# EAGLE schematic common_board_smd (EAGLE 6.5.0)
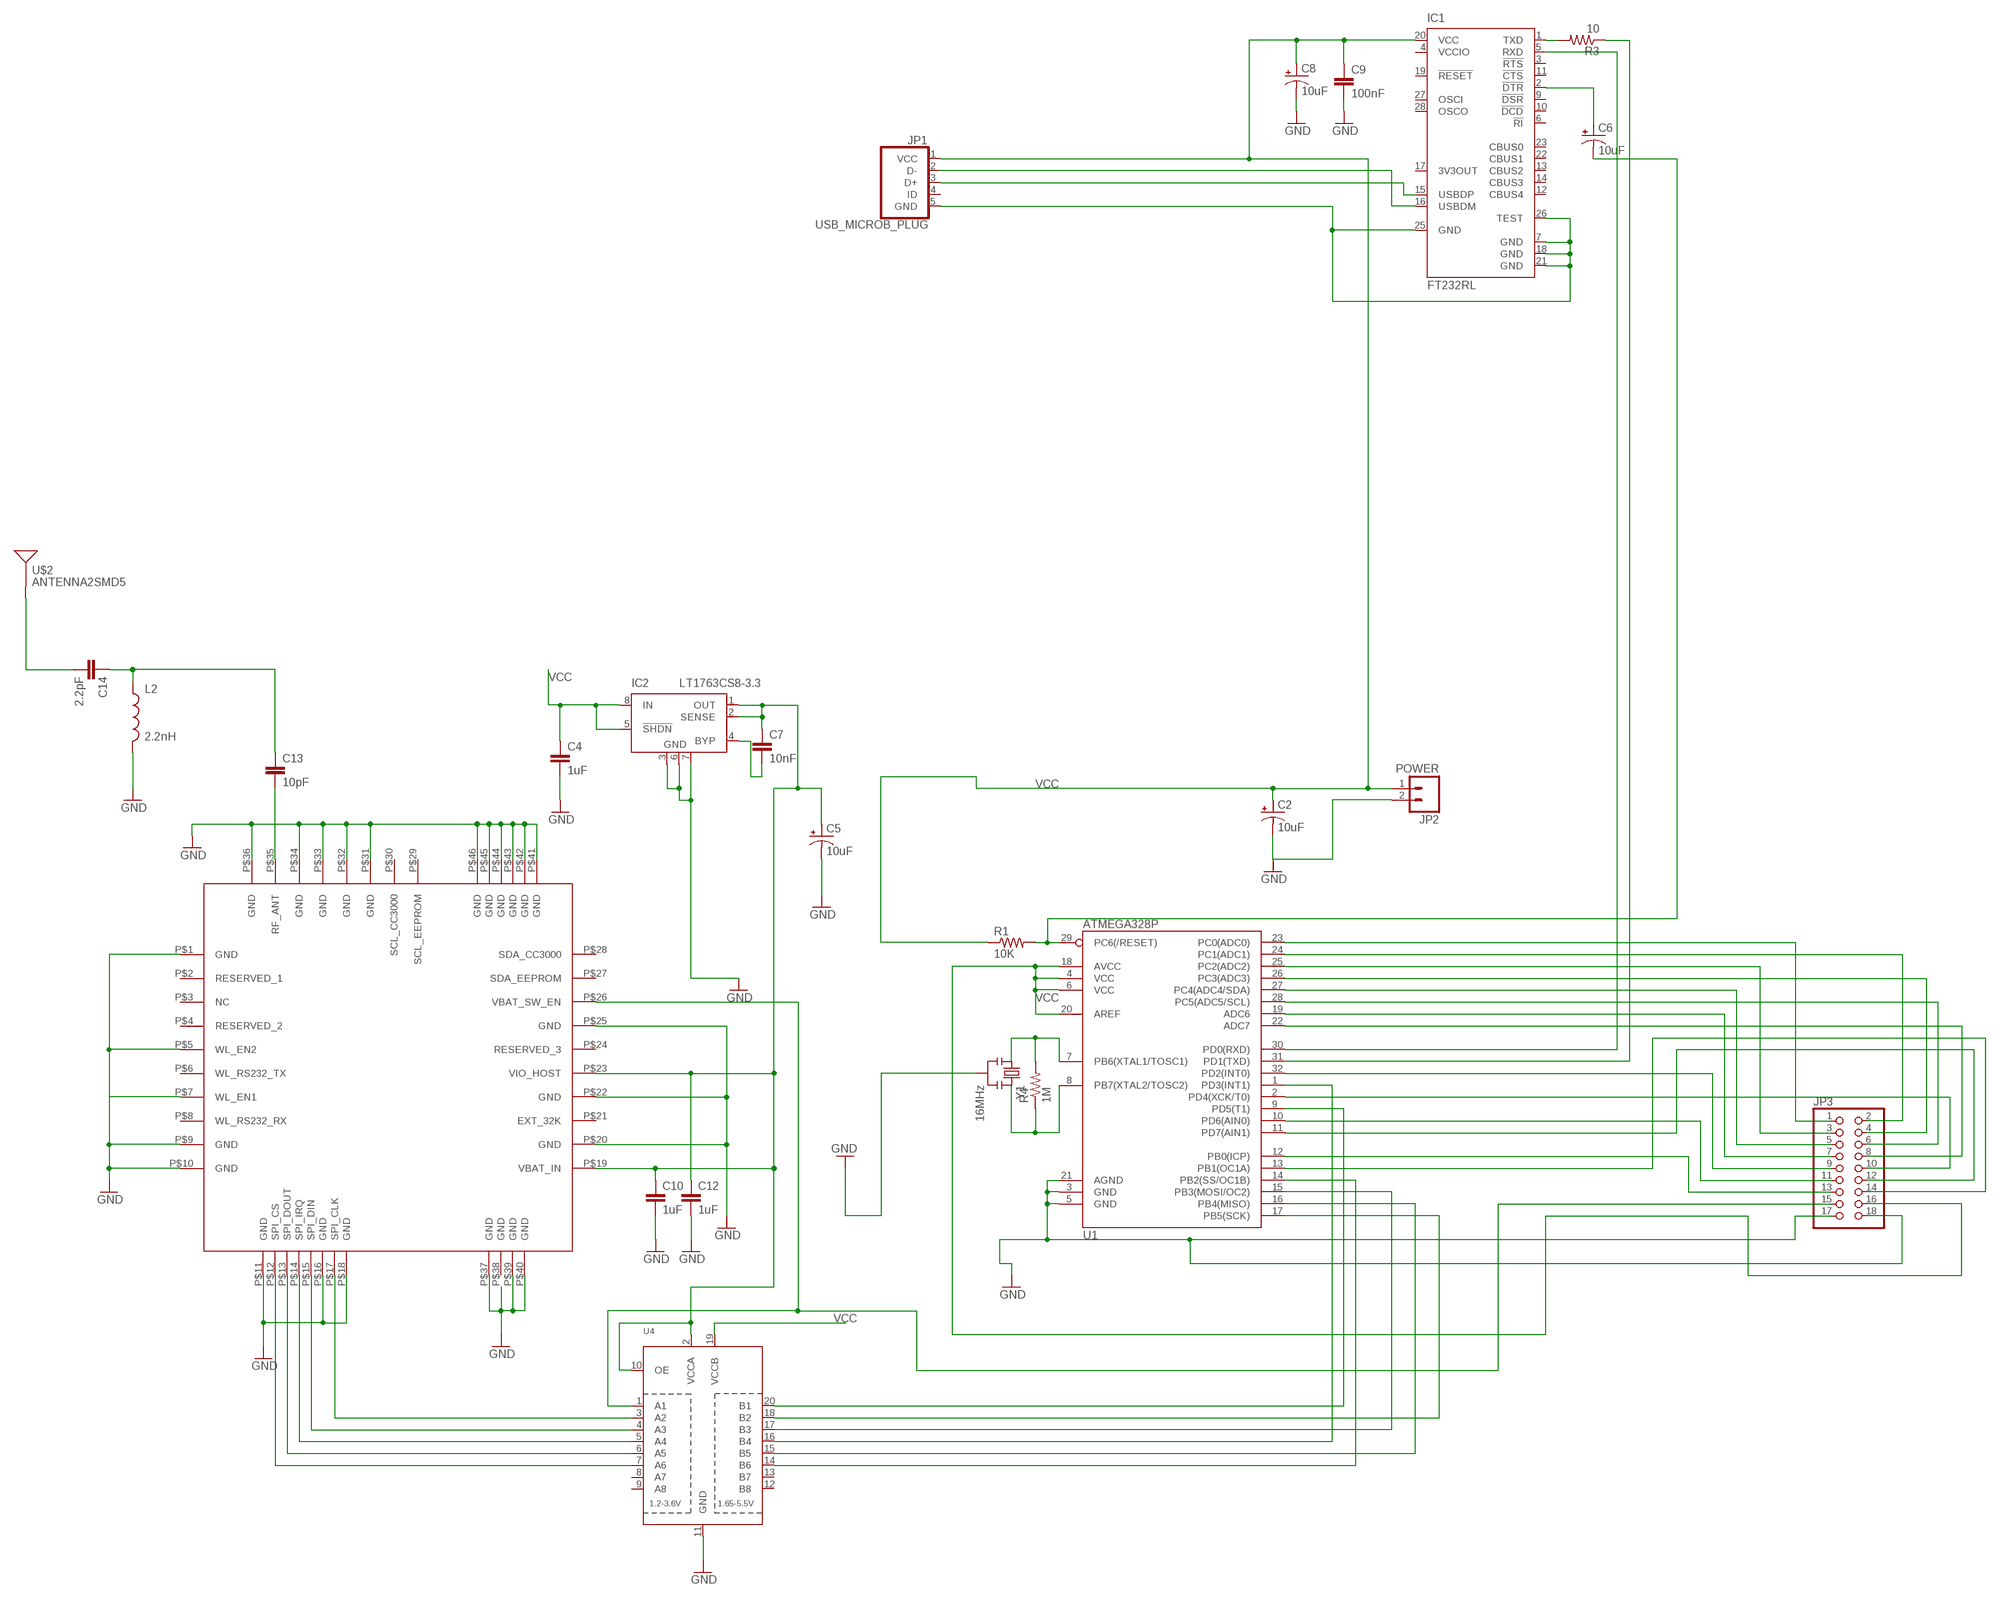
[diagram p0: schematic, sheet 1]

## Parts
C2  10uF  CAP_POL1206  [EIA3216]
C4  1uF  CAP0805  [0805]
C5  10uF  CAP_POL3528  [EIA3528]
C6  10uF  CAP_POL1206  [EIA3216]
C7  10nF  CAP0805  [0805]
C8  10uF  CAP_POL1206  [EIA3216]
C9  100nF  CAP0805  [0805]
C10  1uF  CAP1206  [1206]
C12  1uF  CAP1206  [1206]
C13  10pF  CAP0805  [0805]
C14  2.2pF  CAP0805  [0805]
IC1  FT232RL  [SSOP28]
IC2  LT1763CS8-3.3  [SOIC8]
JP1  USB_MICROB_PLUG  [MICRO-B-RA-SMT]
JP2  POWER  M02PTH  [1X02]
JP3  PINHD-2X9-BIG  [2X09-BIG]
L2  2.2nH  INDUCTOR0805  [0805]
R1  10K  RESISTOR0805-RES  [0805]
R3  10  RESISTOR0805-RES  [0805]
R4  1M  RESISTOR0603-RES  [0603-RES]
U1  ATMEGA328P  ATMEGA328_SMT  [TQFP32-08]
U4  TXB0108PWR  [TSSOP20]
U$1  CC3000  [CC3000]
U$2  ANTENNA2SMD5  [ANTENNA-CHIP5]
Y1  16MHz  RESONATOR16MHZ  [RESONATOR-SMD]

## Nets
GND [gnd]: C2.C(-) C4.2 C5.C(-) C8.C(-) C9.2 C10.2 C12.2 IC2.3(GND) IC2.6(GND) IC2.7(GND) JP2.2 JP3.17 JP3.18 L2.2 U1.3(GND) U1.5(GND) U1.21(AGND) U4.11(GND) U$1.P$1(GND) U$1.P$5(WL_EN2) U$1.P$7(WL_EN1) U$1.P$9(GND) U$1.P$10(GND) U$1.P$11(GND) U$1.P$16(GND) U$1.P$18(GND) U$1.P$20(GND) U$1.P$22(GND) U$1.P$25(GND) U$1.P$31(GND) U$1.P$32(GND) U$1.P$33(GND) U$1.P$34(GND) U$1.P$36(GND) U$1.P$37(GND) U$1.P$39(GND) U$1.P$40(GND) U$1.P$41(GND) U$1.P$42(GND) U$1.P$43(GND) U$1.P$44(GND) U$1.P$45(GND) U$1.P$46(GND) Y1.2
N$1: U1.9(PD5(T1)) U4.20(B1)
N$2: U1.1(PD3(INT1)) U4.16(B4)
N$3: C6.C(-) R1.2 U1.29(PC6(/RESET))
N$4: R4.2 U1.7(PB6(XTAL1/TOSC1)) Y1.1
N$5: U1.17(PB5(SCK)) U4.18(B2)
N$6: U1.14(PB2(SS/OC1B)) U4.14(B6)
N$7: JP3.14 U1.13(PB1(OC1A))
N$8: C5.A(+) C7.1 C10.1 C12.1 IC2.1(OUT) IC2.2(SENSE) U4.2(VCCA) U4.10(OE) U$1.P$19(VBAT_IN) U$1.P$23(VIO_HOST)
N$9: U4.7(A6) U$1.P$12(SPI_CS)
N$10: U4.6(A5) U$1.P$13(SPI_DOUT)
N$11: U4.5(A4) U$1.P$14(SPI_IRQ)
N$12: U4.4(A3) U$1.P$15(SPI_DIN)
N$13: U4.3(A2) U$1.P$17(SPI_CLK)
N$14: JP3.15 U4.1(A1) U$1.P$26(VBAT_SW_EN)
N$15: IC1.1(TXD) R3.2
N$16: C13.2 U$1.P$35(RF_ANT)
N$17: C13.1 C14.1 L2.1
N$18: C14.2 U$2.FEED(SIGNAL)
N$19: U1.16(PB4(MISO)) U4.15(B5)
N$20: U1.15(PB3(MOSI/OC2)) U4.17(B3)
N$21: JP3.9 U1.32(PD2(INT0))
N$22: JP3.13 U1.12(PB0(ICP))
N$23: JP3.3 U1.25(PC2(ADC2))
N$24: JP3.8 U1.22(ADC7)
N$25: JP3.1 U1.23(PC0(ADC0))
N$26: JP3.12 U1.11(PD7(AIN1))
N$27: JP3.2 U1.24(PC1(ADC1))
N$28: IC1.15(USBDP) JP1.3(D+)
N$29: IC1.16(USBDM) JP1.2(D-)
N$30: R3.1 U1.31(PD1(TXD))
N$31: IC1.5(RXD) U1.30(PD0(RXD))
N$32: C6.A(+) IC1.2(!DTR)
N$33: JP3.4 U1.26(PC3(ADC3))
N$34: JP3.5 U1.27(PC4(ADC4/SDA))
N$35: JP3.6 U1.28(PC5(ADC5/SCL))
N$36: JP3.7 U1.19(ADC6)
N$38: JP3.10 U1.2(PD4(XCK/T0))
N$39 [gnd]: IC1.7(GND) IC1.18(GND) IC1.21(GND) IC1.25(GND) IC1.26(TEST) JP1.5(GND)
N$41: R4.1 U1.8(PB7(XTAL2/TOSC2)) Y1.3
N$42: C7.2 IC2.4(BYP)
N$43: JP3.11 U1.10(PD6(AIN0))
VCC [usbvcc]: C2.A(+) C4.1 C8.A(+) C9.1 IC1.20(VCC) IC2.5(!SHDN) IC2.8(IN) JP1.1(VCC) JP2.1 JP3.16 R1.1 U1.4(VCC) U1.6(VCC) U1.18(AVCC) U1.20(AREF) U4.19(VCCB)
Unconnected: IC1.3(!RTS) IC1.6(!RI) IC1.9(!DSR) IC1.10(!DCD) IC1.11(!CTS) IC1.12(CBUS4) IC1.13(CBUS2) IC1.14(CBUS3) IC1.17(3V3OUT) IC1.19(!RESET) IC1.22(CBUS1) IC1.23(CBUS0) IC1.27(OSCI) IC1.28(OSCO) JP1.4(ID) U4.8(A7) U4.9(A8) U4.12(B8) U4.13(B7) U$1.P$2(RESERVED_1) U$1.P$3(NC) U$1.P$4(RESERVED_2) U$1.P$6(WL_RS232_TX) U$1.P$8(WL_RS232_RX) U$1.P$21(EXT_32K) U$1.P$24(RESERVED_3) U$1.P$27(SDA_EEPROM) U$1.P$28(SDA_CC3000) U$1.P$38(GND)

## Power pins joined to a net without a drawn wire
SCL_CC3000: U$1.P$30(SCL_CC3000)
SCL_EEPROM: U$1.P$29(SCL_EEPROM)
VCCIO: IC1.4(VCCIO)

## Library data of the parts
C2 C5 C6 C8 = SparkFun-Passives:CAP_POL: Capacitor Polarized These are standard SMD and PTH capacitors. Normally 10uF, 47uF, and 100uF in electrolytic and tantalum varieties. Always verify the external diameter of the through hole cap, it varies with capacity, voltage, and manufacturer. The EIA devices should be standard.
C4 C7 C9 C10 C12-C14 = SparkFun-Capacitors:CAP: Capacitor Standard 0603 ceramic capacitor, and 0.1" leaded capacitor.
IC1 = ftdichip:FT232R: Source: http://www.ftdichip.com/Documents/DataSheets/DS_FT232R_v104.pdf; MPN: FT232RL; OC_FARNELL: 1146032; OC_NEWARK: 91K9918
IC2 = linear-technology:LT1763CS8: 500mA, Low Noise, LDO Micropower Regulators Source: http://cds.linear.com/docs/Datasheet/1763ff.pdf; MPN: LT1763CS8-3.3; OC_FARNELL: 1273617; OC_NEWARK: 57M6055
JP1 = SparkFun-Connectors:USB_MICROB_PLUG: USB Micro-B Plug Comes in a variety of packages. Check out Hirose's ZX-x0 line: http://www.hirose.co.jp/cataloge_hp/e24200011.pdf
JP2 = SparkFun-Connectors:M02: Standard 2-pin 0.1" header. Use with - straight break away headers ( PRT-00116) - right angle break away headers (PRT-00553) - swiss pins (PRT-00743) - machine pins (PRT-00117) - female headers (PRT-00115) Molex polarized connector foot print use with: PRT-08233 with associated crimp pins and housings. 2.54_SCREWTERM for use with PRT-10571. 3.5mm Screw Terminal footprints for PRT-08084 5mm Screw Terminal footprints for use with PRT-08433
JP3 = adafruit:PINHD-2X9: PIN HEADER With larger annulars
L2 = SparkFun-Passives:INDUCTOR: Inductors Basic Inductor/Choke - 0603 and 1206. Footprints are not proven and vary greatly between part numbers. SRN6045- 33uH, 20% 1.4A
R1 R3 = SparkFun-Passives:RESISTOR: Resistor Basic schematic elements and footprints for 0603, 1206, and PTH resistors.
R4 = SparkFun-Resistors:RESISTOR: Resistor Basic schematic elements and footprints for 0603, 1206, and PTH resistors.
U1 = SparkFun-DigitalIC:ATMEGA328_SMT: 32-Pin Atmega328 part Commonly used on Arduino compatible boards Available in QFP and QFN packages TQFP is IC-09069 QFN is non-stock; PROD_ID: IC-09069
U4 = adafruit:TXB0108PWR: 8-Bit Bi-Directional Level Shifter 1.2V-3.6V (VCCA) to 1.65V-5.5V (VCCB) bi-directional level shifter with auto direction sensing. Max data rate - VCCA 1.8V: 20Mbps (50ns), VCCA 3.3V: 100Mbps (10ns) Digikey: 296-21527-1-ND
U$1 = centerblack_engineering:CC3000: TI SimpleLink CC3000 Module - WiFi 802.11b/g Network Processor; AUTHOR: Matt Bigarani; DATASHEET: http://www.ti.com/lit/ds/symlink/cc3000.pdf; DATE: 2/8/2013
U$2 = SparkFun-RF-Modified:ANTENNA2: Chip antenna Single endded antenna. Common with smaller chip antennas. CHIP4 package is the GPS Chip Antenna SKU: GPS-08418. CHIP5 package is 2.4GHz chip antenna SKU: WRL-00144.
Y1 = SparkFun-FreqCtrl:RESONATOR: Resonator Small SMD resonator. Used, eg, on the Arduino Pro/ Pro Mini boards. 8MHz- XTAL-08895 16MHz- XTAL-08900; PROD_ID: XTAL-08900

## Net classes
0 default: width 0.152 mm, clearance 0.152 mm
1 power: width 0.61 mm, drill 0.61 mm, clearance 0.254 mm
2 gnd: width 0.203 mm, drill 0.559 mm, clearance 0.152 mm
3 usbvcc: width 0.203 mm, drill 0.61 mm, clearance 0.152 mm
4 aref: width 0.406 mm, drill 0.61 mm, clearance 0.254 mm